# EAGLE design mcat-4cu-v2 (EAGLE 6.5.0)

## Sheet 1 of 4
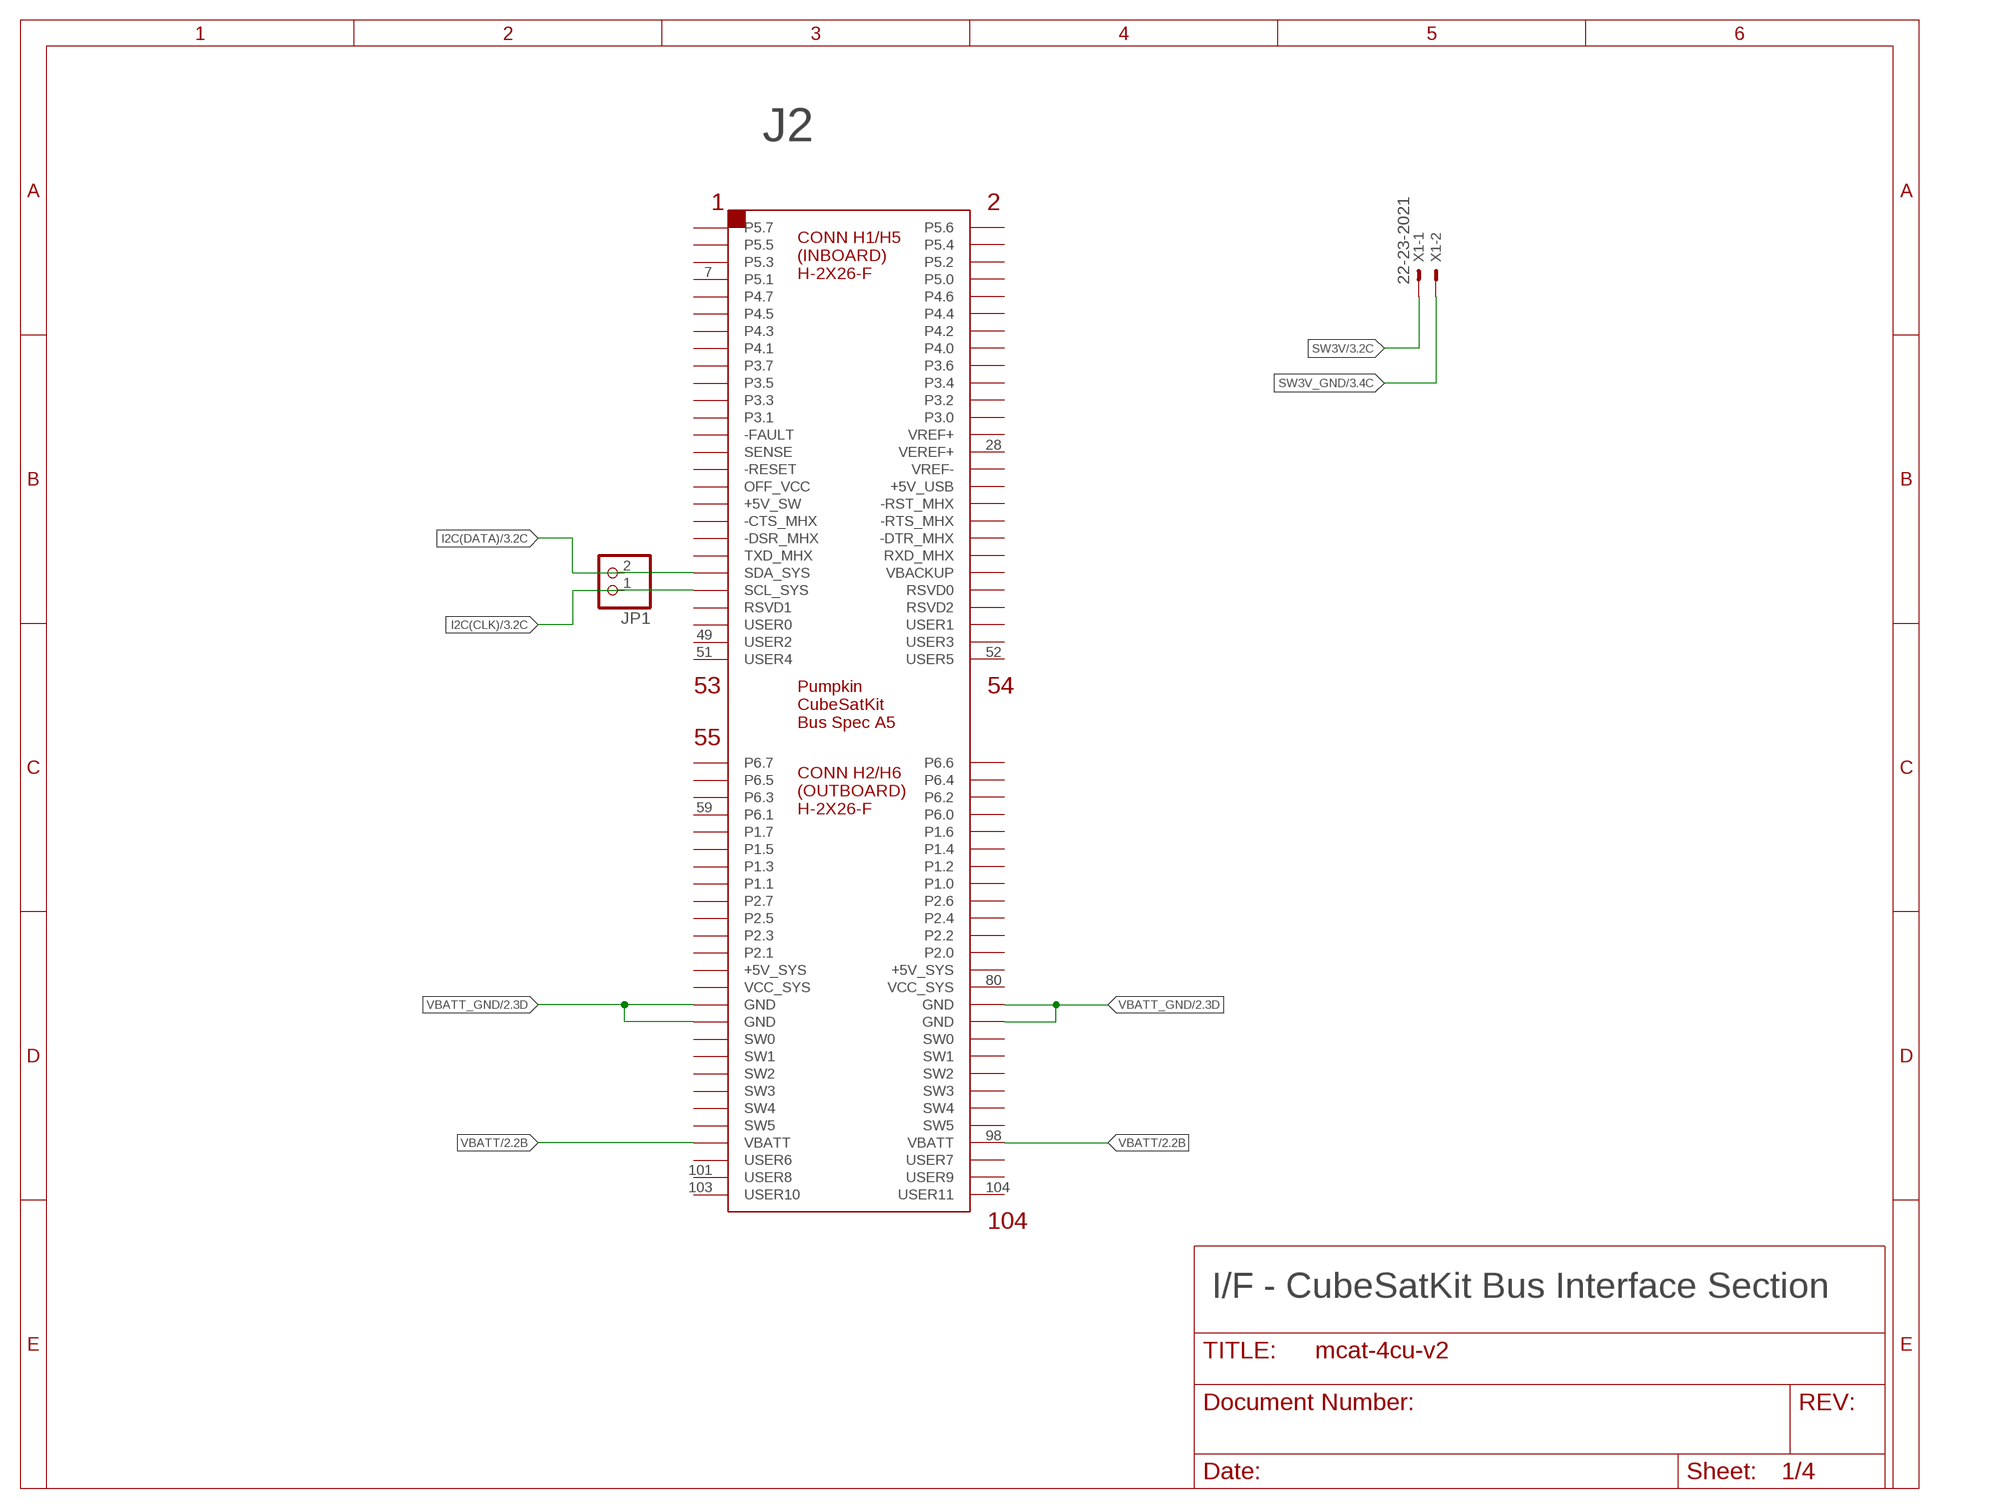
[diagram p0: schematic, sheet 1]

### Parts
J2  CSK-BUS-CONN2X2X26  [CSK-BUS-PKG]
JP1  PINHD-1X2  [1X02]
X1  22-23-2021  [22-23-2021]

### Nets
I2C(CLK): J2.43(SCL_SYS) JP1.1 ; also sheet 3
I2C(DATA): J2.41(SDA_SYS) JP1.2 ; also sheet 3
N$6: J2.82(GND) J2.84(GND)
SW3V: X1.1 ; also sheet 3
SW3V_GND: X1.2 ; also sheet 3
VBATT: J2.97(VBATT) J2.98(VBATT) ; also sheet 2
VBATT_GND: J2.81(GND) J2.83(GND) ; also sheet 2
Unconnected: J2.1(P5.7) J2.2(P5.6) J2.3(P5.5) J2.4(P5.4) J2.5(P5.3) J2.6(P5.2) J2.7(P5.1) J2.8(P5.0) J2.9(P4.7) J2.10(P4.6) J2.11(P4.5) J2.12(P4.4) J2.13(P4.3) J2.14(P4.2) J2.15(P4.1) J2.16(P4.0) J2.17(P3.7) J2.18(P3.6) J2.19(P3.5) J2.20(P3.4) J2.21(P3.3) J2.22(P3.2) J2.23(P3.1) J2.24(P3.0) J2.25(-FAULT) J2.26(VREF+) J2.27(SENSE) J2.28(VEREF+) J2.29(-RESET) J2.30(VREF-) J2.31(OFF_VCC) J2.32(+5V_USB) J2.33(+5V_SW) J2.34(-RST_MHX) J2.35(-CTS_MHX) J2.36(-RTS_MHX) J2.37(-DSR_MHX) J2.38(-DTR_MHX) J2.39(TXD_MHX) J2.40(RXD_MHX) J2.42(VBACKUP) J2.44(RSVD0) J2.45(RSVD1) J2.46(RSVD2) J2.47(USER0) J2.48(USER1) J2.49(USER2) J2.50(USER3) J2.51(USER4) J2.52(USER5) J2.53(P6.7) J2.54(P6.6) J2.55(P6.5) J2.56(P6.4) J2.57(P6.3) J2.58(P6.2) J2.59(P6.1) J2.60(P6.0) J2.61(P1.7) J2.62(P1.6) J2.63(P1.5) J2.64(P1.4) J2.65(P1.3) J2.66(P1.2) J2.67(P1.1) J2.68(P1.0) J2.69(P2.7) J2.70(P2.6) J2.71(P2.5) J2.72(P2.4) J2.73(P2.3) J2.74(P2.2) J2.75(P2.1) J2.76(P2.0) J2.77(+5V_SYS) J2.78(+5V_SYS) J2.79(VCC_SYS) J2.80(VCC_SYS) J2.85(SW0) J2.86(SW0) J2.87(SW1) J2.88(SW1) J2.89(SW2) J2.90(SW2) J2.91(SW3) J2.92(SW3) J2.93(SW4) J2.94(SW4) J2.95(SW5) J2.96(SW5) J2.99(USER6) J2.100(USER7) J2.101(USER8) J2.102(USER9) J2.103(USER10) J2.104(USER11)

### Notes on the sheet
- I/F - CubeSatKit Bus Interface Section

## Sheet 2 of 4
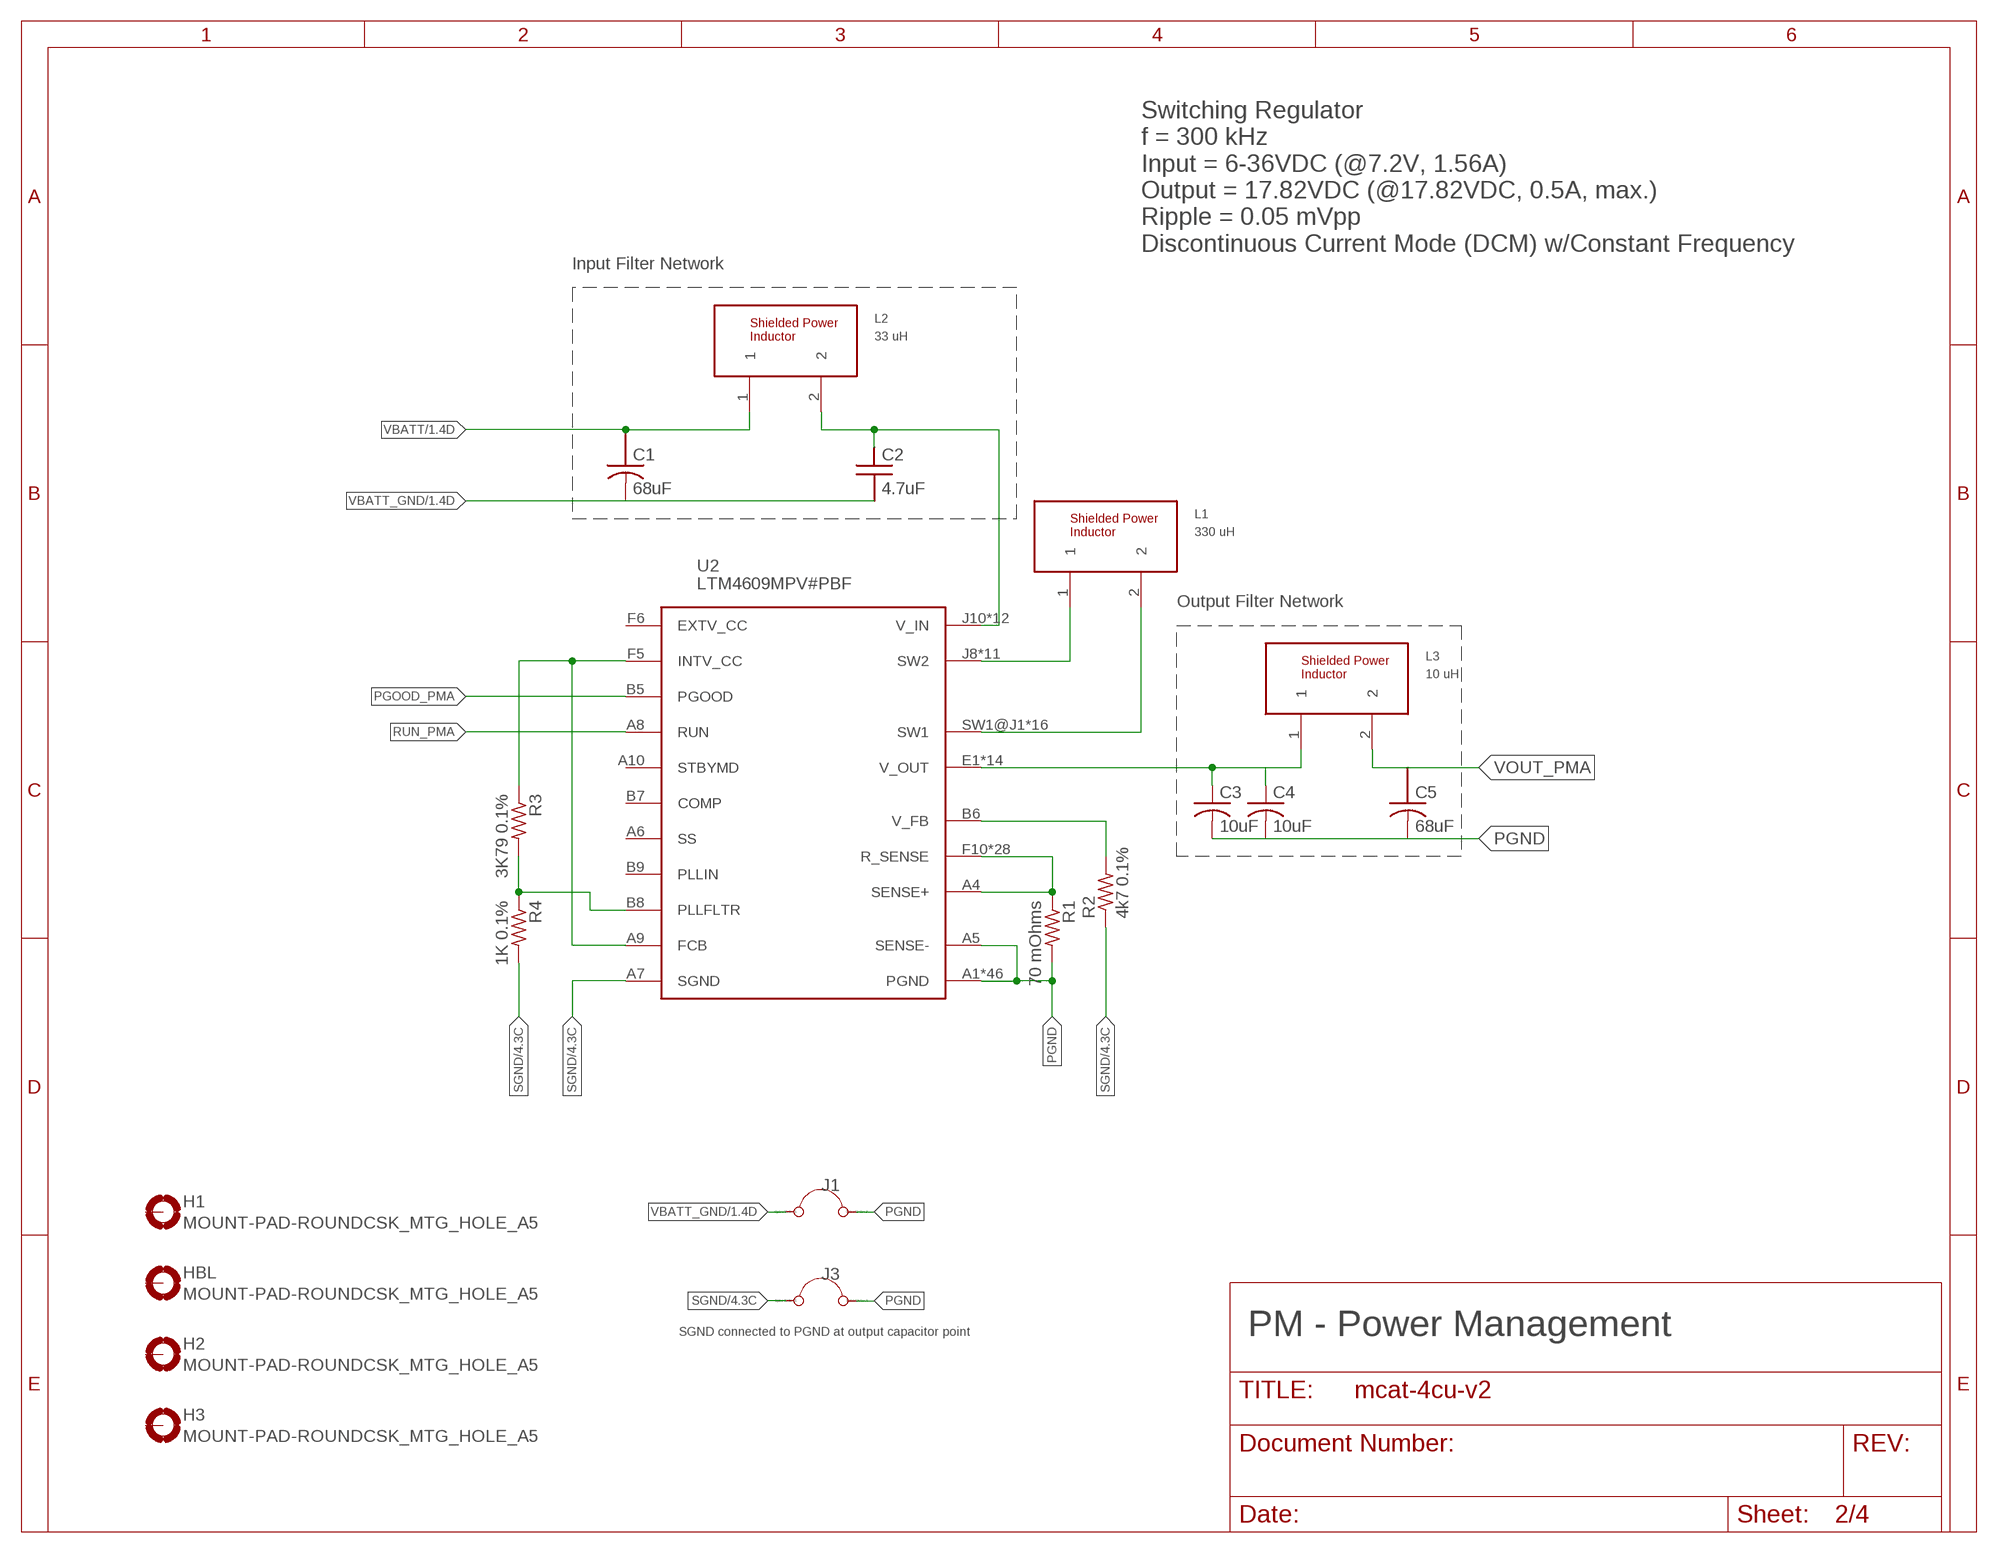
[diagram p1: schematic, sheet 2]

### Parts
C1  68uF  OSCON-50SVPF68M  [OS-CON-SVPF-F12]
C2  4.7uF  AVX-LD105C475KAB2A  [MLCC-X7R-1210]
C3  10uF  C-USC1210K  [C1210K]
C4  10uF  C-USC1210K  [C1210K]
C5  68uF  OSCON-50SVPF68M  [OS-CON-SVPF-F12]
H1  MOUNT-PAD-ROUNDCSK_MTG_HOLE_A5  [CSK_MOUNTING_HOLE]
H2  MOUNT-PAD-ROUNDCSK_MTG_HOLE_A5  [CSK_MOUNTING_HOLE]
H3  MOUNT-PAD-ROUNDCSK_MTG_HOLE_A5  [CSK_MOUNTING_HOLE]
HBL  MOUNT-PAD-ROUNDCSK_MTG_HOLE_A5  [CSK_MOUNTING_HOLE]
J1  JUMPER  [05]
J3  JUMPER  [05]
L1  330 uH  MSS1048-334KL_  [MSS1048]
L2  33 uH  MSS1038-333ML_  [MSS1048]
L3  10 uH  ELL-5PS100M  [SERIES-POWER-INDUCTORS]
R1  70 mOhms  R-US_R1206  [R1206]
R2  4k7 0.1%  R-US_R0603  [R0603]
R3  3K79 0.1%  R-US_R0805  [R0805]
R4  1K 0.1%  R-US_R0805  [R0805]
U2  LTM4609MPV#PBF  LTM4609MPV#PBFROHS/HITEMP  [LGA-141-LTC-05-08-1840-B]

### Nets
INTVCC_OUT: R3.1 U2.A9(FCB) U2.F5(INTV_CC)
N$2: R1.1 U2.A4(SENSE+) U2.F10(R_SENSE) U2.F11(R_SENSE) U2.F12(R_SENSE) U2.G5(R_SENSE) U2.G6(R_SENSE) U2.G7(R_SENSE) U2.G8(R_SENSE) U2.G9(R_SENSE) U2.G10(R_SENSE) U2.G11(R_SENSE) U2.G12(R_SENSE) U2.H5(R_SENSE) U2.H6(R_SENSE) U2.H7(R_SENSE) U2.H8(R_SENSE) U2.H9(R_SENSE) U2.H10(R_SENSE) U2.H11(R_SENSE) U2.H12(R_SENSE) U2.J5(R_SENSE) U2.J6(R_SENSE) U2.J7(R_SENSE) U2.K5(R_SENSE) U2.K6(R_SENSE) U2.L5(R_SENSE) U2.L6(R_SENSE) U2.M5(R_SENSE) U2.M6(R_SENSE)
N$8: R2.2 U2.B6(V_FB)
PGND: C3.2 C4.2 C5.K1(K) J1.2(-) J3.2(-) R1.2 U2.A1(PGND) U2.A2(PGND) U2.A3(PGND) U2.A5(SENSE-) U2.A11(PGND) U2.A12(PGND) U2.B1(PGND) U2.B2(PGND) U2.B3(PGND) U2.B4(PGND) U2.B10(PGND) U2.B11(PGND) U2.B12(PGND) U2.C1(PGND) U2.C2(PGND) U2.C3(PGND) U2.C4(PGND) U2.C5(PGND) U2.C6(PGND) U2.C7(PGND) U2.C8(PGND) U2.C9(PGND) U2.C10(PGND) U2.C11(PGND) U2.C12(PGND) U2.D1(PGND) U2.D2(PGND) U2.D3(PGND) U2.D4(PGND) U2.D5(PGND) U2.D6(PGND) U2.D7(PGND) U2.D8(PGND) U2.D9(PGND) U2.D10(PGND) U2.D11(PGND) U2.D12(PGND) U2.E3(PGND) U2.E4(PGND) U2.E5(PGND) U2.E6(PGND) U2.E7(PGND) U2.E8(PGND) U2.E9(PGND) U2.E10(PGND) U2.E11(PGND) U2.E12(PGND)
PGOOD_PMA: U2.B5(PGOOD)
RUN_PMA: U2.A8(RUN)
SETFREQ: R3.2 R4.1 U2.B8(PLLFLTR)
SGND: J3.1(+) R2.1 R4.2 U2.A7(SGND) ; also sheet 4
SW1: L1.2 U2.SW1@J1(SW1) U2.SW1@J2(SW1) U2.SW1@J3(SW1) U2.SW1@J4(SW1) U2.SW1@K1(SW1) U2.SW1@K2(SW1) U2.SW1@K3(SW1) U2.SW1@K4(SW1) U2.SW1@L1(SW1) U2.SW1@L2(SW1) U2.SW1@L3(SW1) U2.SW1@L4(SW1) U2.SW1@M1(SW1) U2.SW1@M2(SW1) U2.SW1@M3(SW1) U2.SW1@M4(SW1)
SW2: L1.1 U2.J8(SW2) U2.J9(SW2) U2.K7(SW2) U2.K8(SW2) U2.K9(SW2) U2.L7(SW2) U2.L8(SW2) U2.L9(SW2) U2.M7(SW2) U2.M8(SW2) U2.M9(SW2)
VBATT: C1.A1(A) L2.1 ; also sheet 1
VBATT_GND: C1.K1(K) C2.2 J1.1(+) ; also sheet 1
VIN_PMA: C2.1 L2.2 U2.J10(V_IN) U2.J11(V_IN) U2.J12(V_IN) U2.K10(V_IN) U2.K11(V_IN) U2.K12(V_IN) U2.L10(V_IN) U2.L11(V_IN) U2.L12(V_IN) U2.M10(V_IN) U2.M11(V_IN) U2.M12(V_IN)
VOUT_PMA: C5.A1(A) L3.2
VOUTA: C3.1 C4.1 L3.1 U2.E1(V_OUT) U2.E2(V_OUT) U2.F1(V_OUT) U2.F2(V_OUT) U2.F3(V_OUT) U2.F4(V_OUT) U2.G1(V_OUT) U2.G2(V_OUT) U2.G3(V_OUT) U2.G4(V_OUT) U2.H2(V_OUT) U2.H3(V_OUT) U2.H4(V_OUT) U2.VOUT(V_OUT)
Unconnected: H1.P$1(MOUNT) H2.P$1(MOUNT) H3.P$1(MOUNT) HBL.P$1(MOUNT) U2.A6(SS) U2.A10(STBYMD) U2.B7(COMP) U2.B9(PLLIN) U2.F6(EXTV_CC)

### Notes on the sheet
- Switching Regulator
  f = 300 kHz
  Input = 6-36VDC (@7.2V, 1.56A)
  Output = 17.82VDC (@17.82VDC, 0.5A, max.)
  Ripple = 0.05 mVpp
  Discontinuous Current Mode (DCM) w/Constant Frequency
- Input Filter Network
- Output Filter Network
- SGND connected to PGND at output capacitor point | PM - Power Management

## Sheet 3 of 4
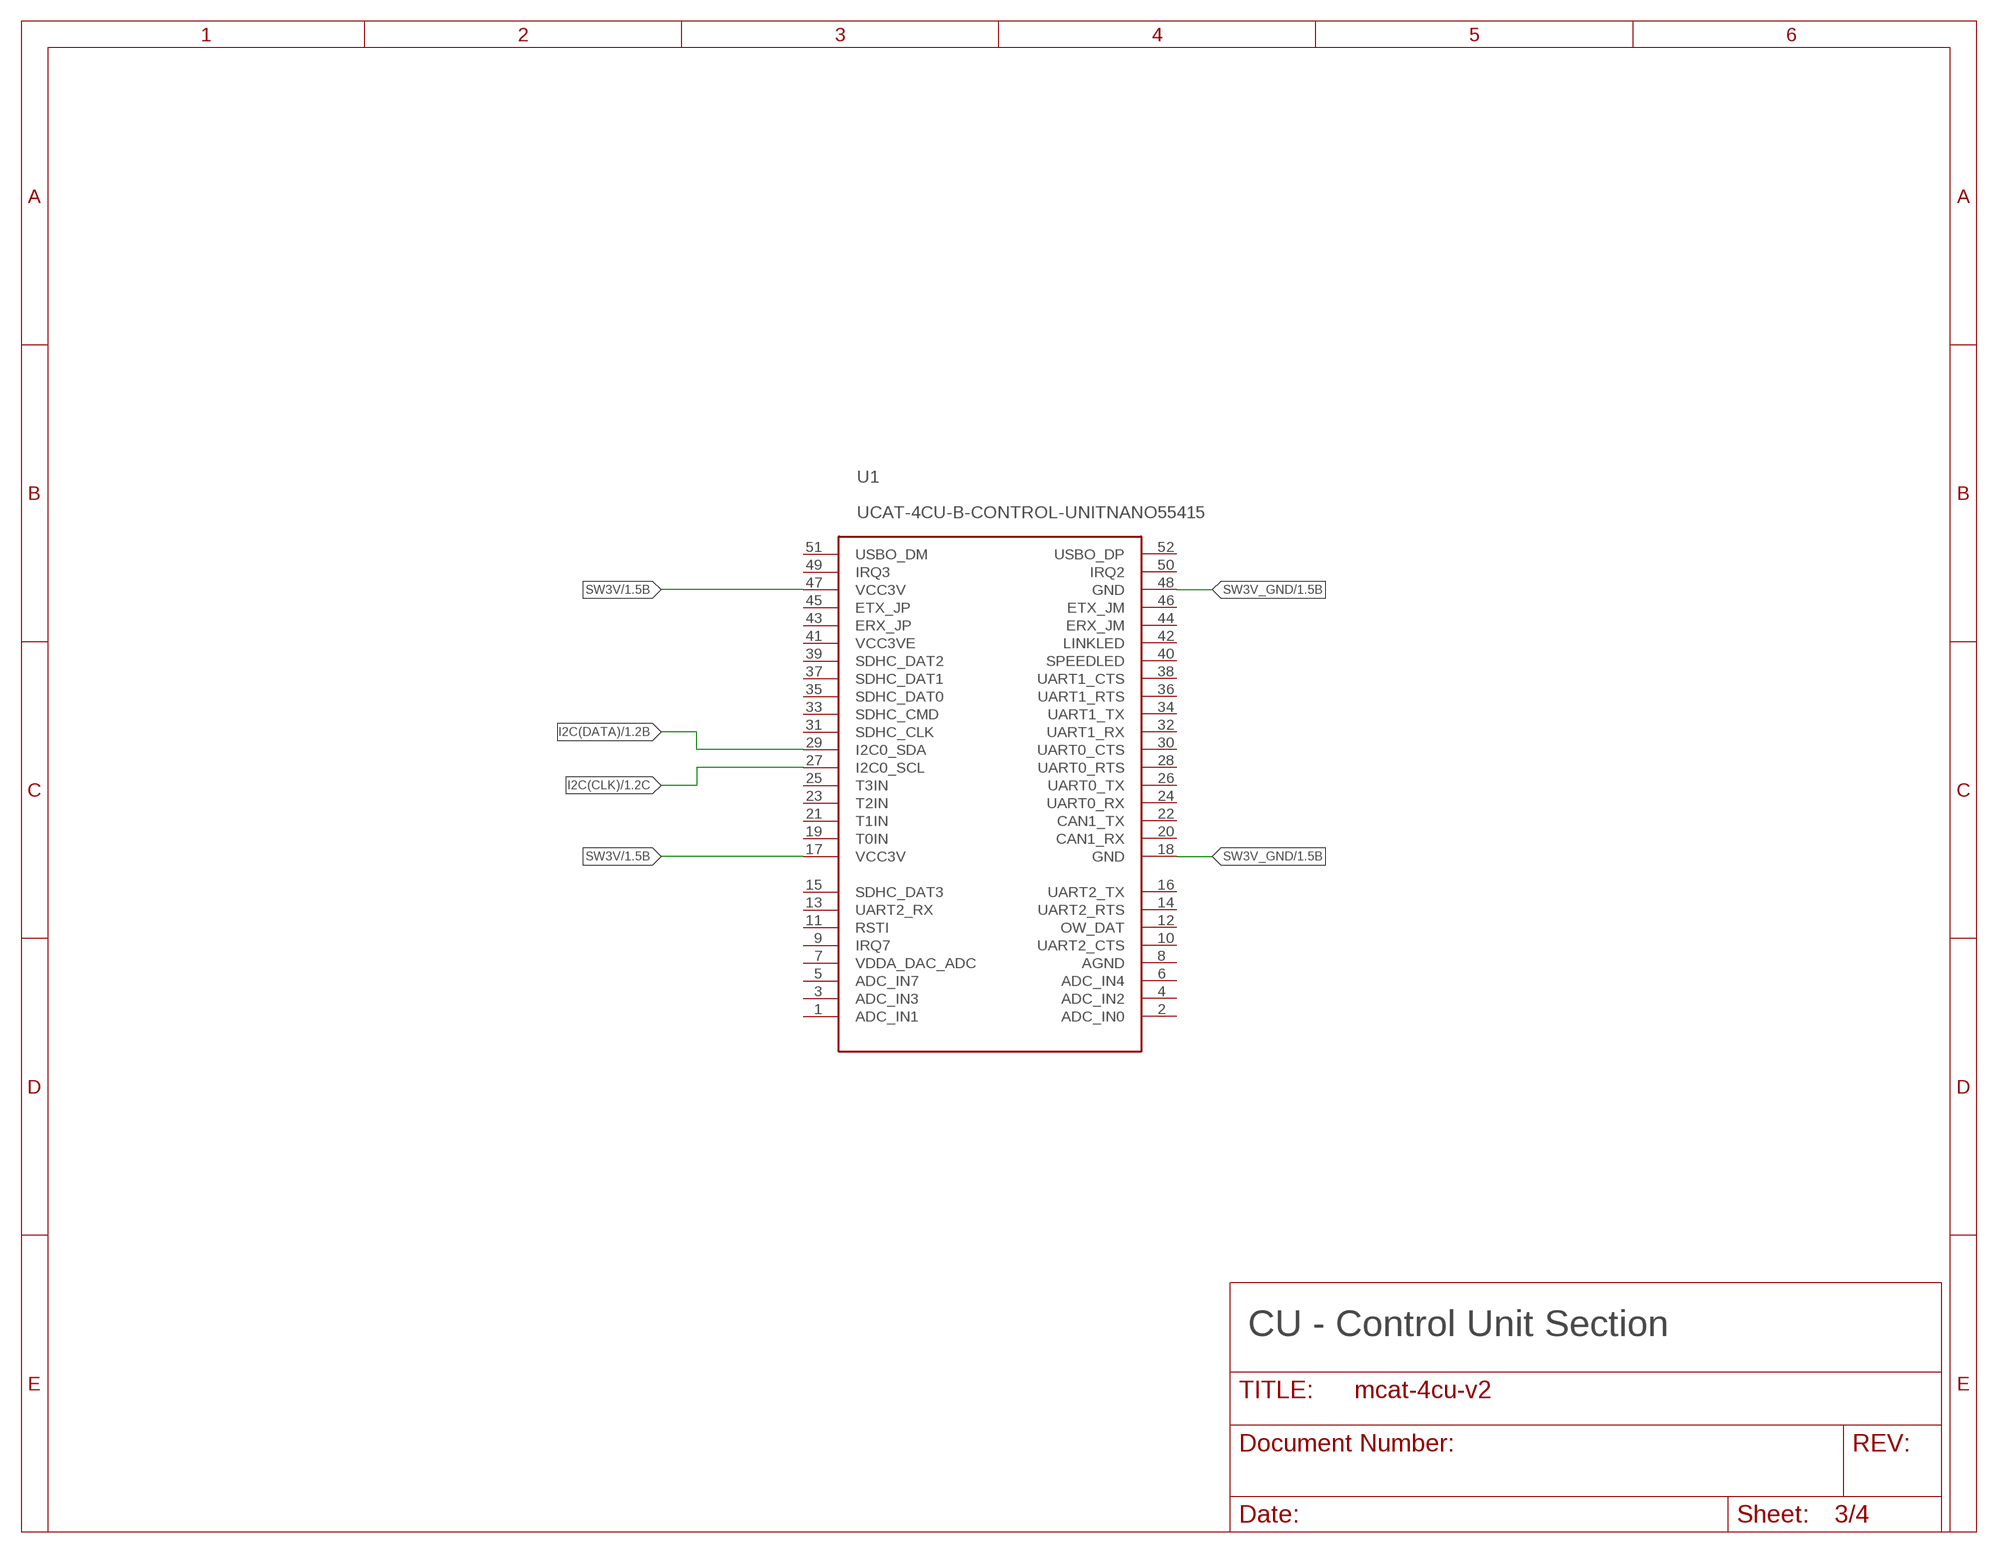
[diagram p2: schematic, sheet 3]

### Parts
U1  UCAT-4CU-B-CONTROL-UNITNANO55415  [MOLEX-MINI-PCI-EXPRESS-8MM-52CKT]

### Nets
I2C(CLK): U1.27(I2C0_SCL) ; also sheet 1
I2C(DATA): U1.29(I2C0_SDA) ; also sheet 1
N$3: U1.18(GND)
SW3V: U1.17(VCC3V) U1.47(VCC3V) ; also sheet 1
SW3V_GND: U1.48(GND) ; also sheet 1
Unconnected: U1.1(ADC_IN1) U1.2(ADC_IN0) U1.3(ADC_IN3) U1.4(ADC_IN2) U1.5(ADC_IN7) U1.6(ADC_IN4) U1.7(VDDA_DAC_ADC) U1.8(AGND) U1.9(IRQ7) U1.10(UART2_CTS) U1.11(RSTI) U1.12(OW_DAT) U1.13(UART2_RX) U1.14(UART2_RTS) U1.15(SDHC_DAT3) U1.16(UART2_TX) U1.19(T0IN) U1.20(CAN1_RX) U1.21(T1IN) U1.22(CAN1_TX) U1.23(T2IN) U1.24(UART0_RX) U1.25(T3IN) U1.26(UART0_TX) U1.28(UART0_RTS) U1.30(UART0_CTS) U1.31(SDHC_CLK) U1.32(UART1_RX) U1.33(SDHC_CMD) U1.34(UART1_TX) U1.35(SDHC_DAT0) U1.36(UART1_RTS) U1.37(SDHC_DAT1) U1.38(UART1_CTS) U1.39(SDHC_DAT2) U1.40(SPEEDLED) U1.41(VCC3VE) U1.42(LINKLED) U1.43(ERX_JP) U1.44(ERX_JM) U1.45(ETX_JP) U1.46(ETX_JM) U1.49(IRQ3) U1.50(IRQ2) U1.51(USBO_DM) U1.52(USBO_DP)

### Notes on the sheet
- CU - Control Unit Section

## Sheet 4 of 4
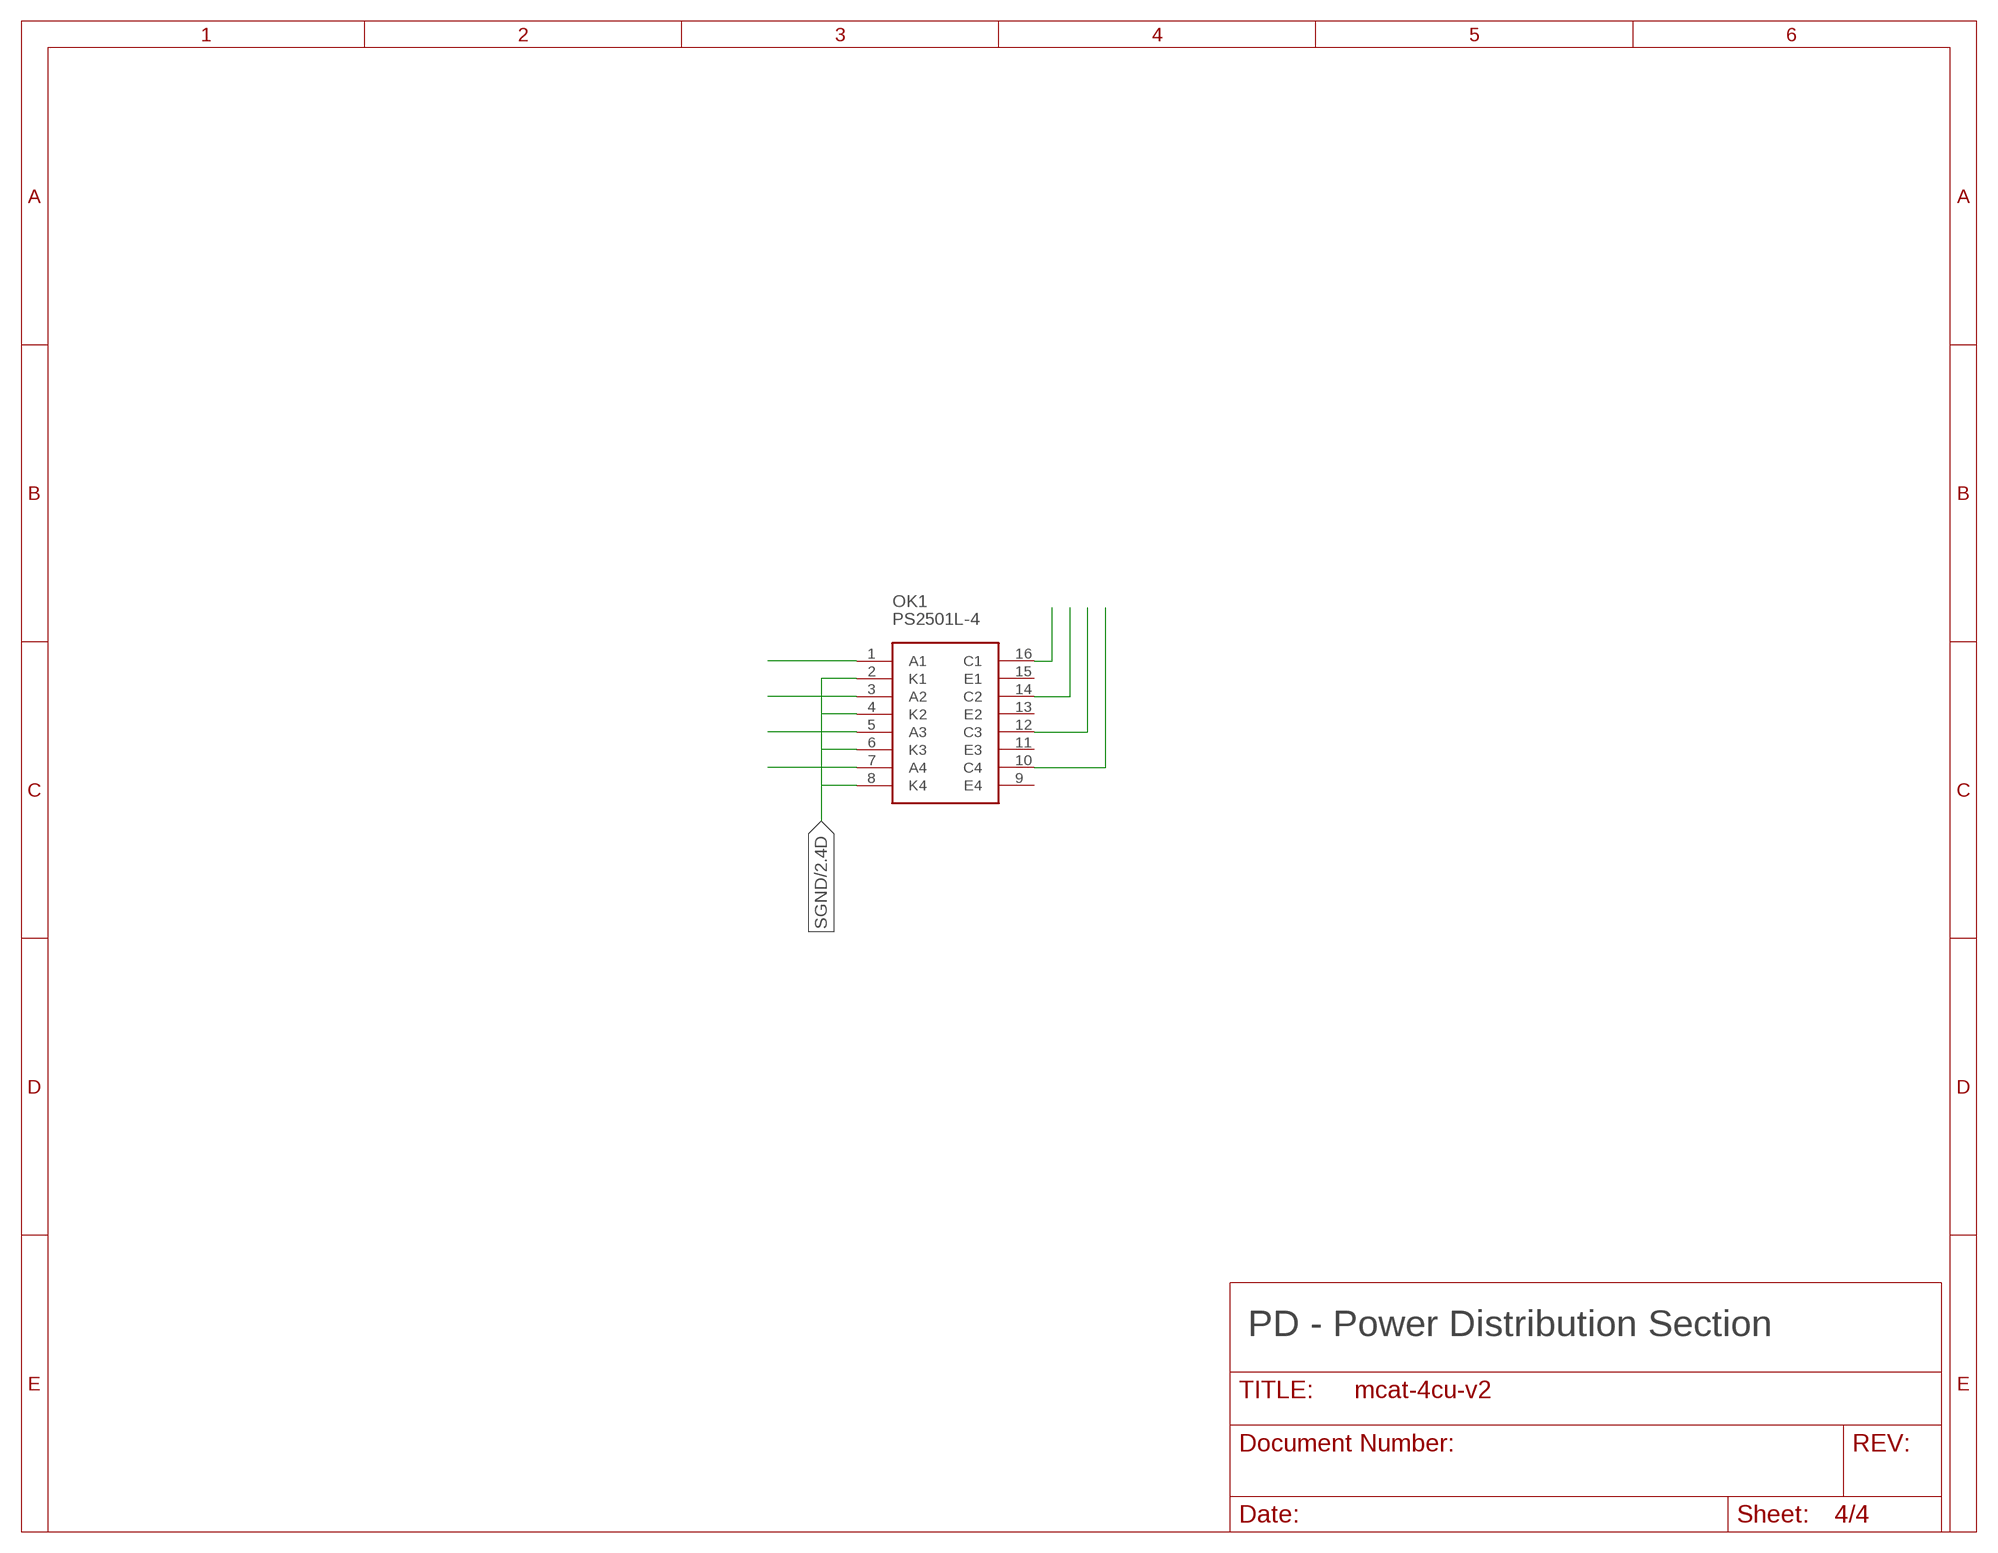
[diagram p3: schematic, sheet 4]

### Parts
OK1  PS2501L-4  [PS2501L-4]

### Nets
N$4: OK1.16(C1)
N$5: OK1.14(C2)
N$7: OK1.12(C3)
N$9: OK1.10(C4)
N$10: OK1.1(A1)
N$11: OK1.3(A2)
N$12: OK1.5(A3)
N$13: OK1.7(A4)
SGND: OK1.2(K1) OK1.4(K2) OK1.6(K3) OK1.8(K4) ; also sheet 2
Unconnected: OK1.9(E4) OK1.11(E3) OK1.13(E2) OK1.15(E1)

### Notes on the sheet
- PD - Power Distribution Section

## Library data of the parts
C1 C5 = gwu_mpnl_ucat_v8:OSCON-50SVPF
C2 = gwu_mpnl_ucat_v8:AVX-LD105C475KAB2A
C3 C4 = rcl:C-US: CAPACITOR, American symbol
H1-H3 HBL = mpnl_holes:MOUNT-PAD-ROUND: MOUNTING PAD, round
J1 J3 = Misc:JUMPER: A wire jumper. This component lets you give the same net two different names
J2 = gwu_mpnl_ucat_v8:CSK-BUS-CONN: Cubesat Kit Bus Connector 2 x Samtec ESQ-126-39-G-D Connectors 104 pins per Cubesat Kit Bus Spec A5
JP1 = pinhead:PINHD-1X2: PIN HEADER
L1 = gwu_mpnl_ucat_v8:MSS1048
L2 = gwu_mpnl_ucat_v8:MSS1038
L3 = gwu_mpnl_ucat_v8:ELL-5PS100M; MF: PANASONIC; MPN: ELL5PS100M; OC_FARNELL: 1717452
OK1 = gwu_mpnl_ucat_v8:PS2501L-4
R1 R2 = resistor:R-US_: RESISTOR, American symbol
R3 R4 = rcl:R-US_: RESISTOR, American symbol
U1 = gwu_mpnl_ucat_v8:UCAT-4CU-B-CONTROL-UNIT
U2 = gwu_mpnl_ucat_v8:LTM4609MPV#PBF: Per LTC Datasheet 4609fe LTM4609 (c) Samudra Haque, N3RDX, 2/23/2014
X1 = con-molex:22-23-2021: .100" (2.54mm) Center Header - 2 Pin; MF: MOLEX; MPN: 22-23-2021; OC_FARNELL: 1462926; OC_NEWARK: 25C3832

## Net classes
0 default: clearance 0.205 mm

## Board
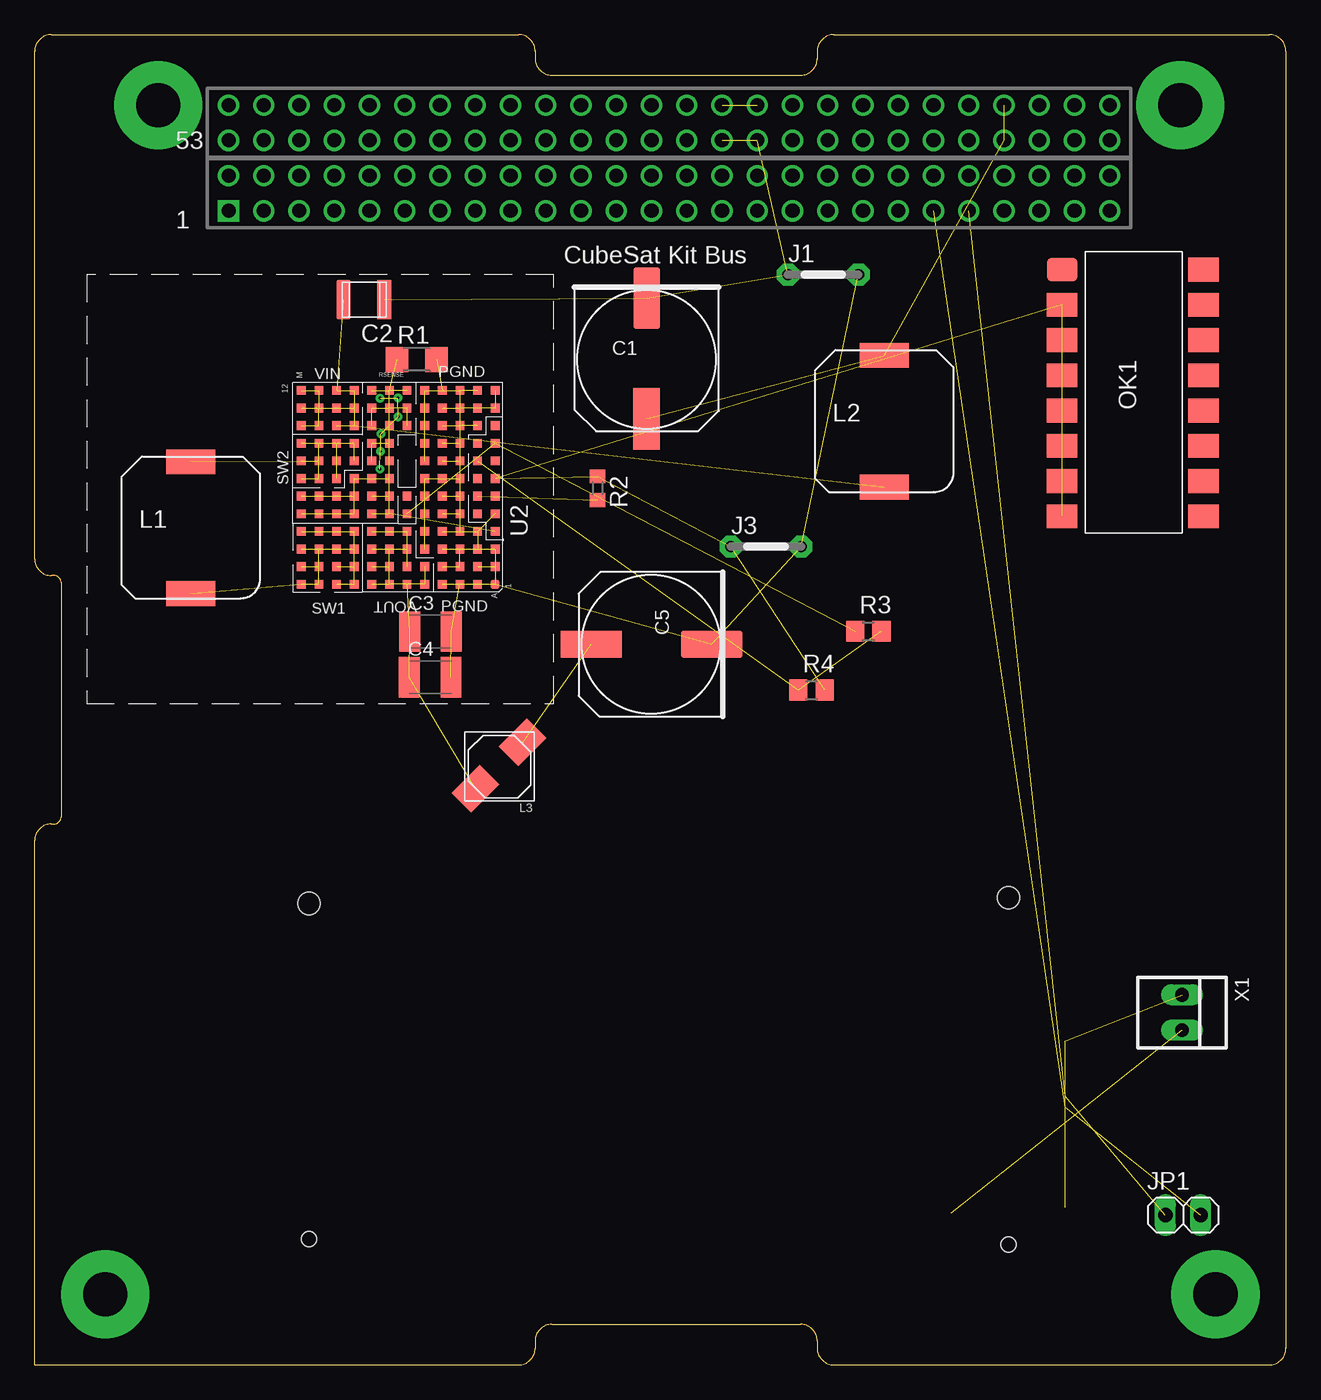
[diagram p4: board, top side]
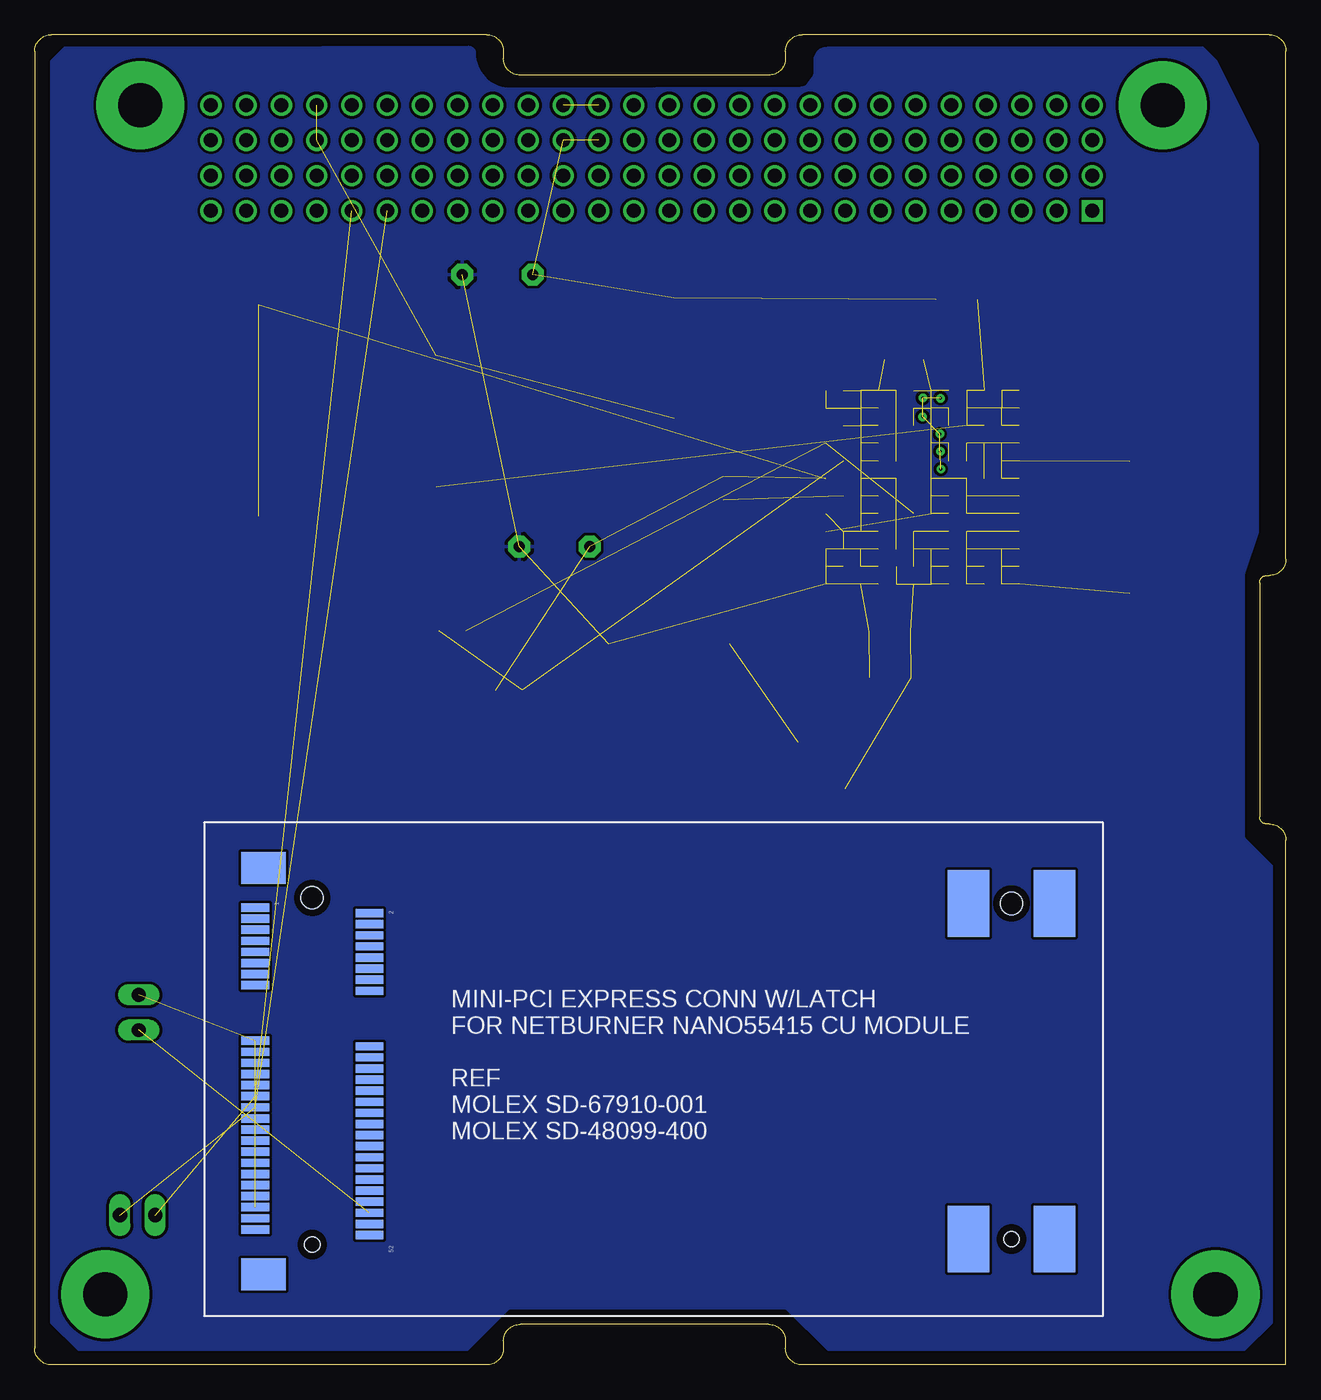
[diagram p5: board, bottom side, seen from below]

Size 90.17 x 95.89 mm. Coordinates in mm from the lower left corner, seen from the top.
Outline: 0,0 34.87,0 arc90 36.07,1.19 36.07,1.73 arc-90 37.26,2.92 55.19,2.92 arc-90 56.39,1.73 56.39,1.19 arc90 57.58,0 88.98,0 arc90 90.17,1.19 90.17,94.69 arc90 88.98,95.89 57.58,95.89 arc90 56.39,94.69 56.39,94.16 arc-90 55.19,92.96 37.26,92.96 arc-90 36.07,94.16 36.07,94.69 arc90 34.87,95.89 1.19,95.89 arc90 0,94.69 0,58.09 arc90 1.19,56.9 1.4,56.9 arc-90 1.91,56.39 1.91,39.5 arc-90 1.4,38.99 1.19,38.99 arc90 0,37.8 0,0
Copper layers [2:(1+(2*15)+16):15]: Top 0.0694mm / dielectric 8mil / Route2 0.0347mm / dielectric 3.5mil / Route15 0.0347mm / dielectric 8mil / Bottom 0.0694mm
Design rules "SSC-EAGLE-6Lyr_v1.0.0.3 *": minimum track width 6mil, minimum drill 8mil, track to track 6mil, track to pad 6mil, pad to pad 6mil, via to via 6mil, smd to smd 6mil, copper to edge 20mil, drill to drill 16mil, minimum pad ring 8mil, minimum via ring 8mil, stop-mask expansion 3mil, vias tented up to drill 0mil, thermal gap 10mil

### Footprints (pad centres in the part's own frame; a part is rotated, then mirrored left to right if it is on the bottom)
OS-CON-SVPF-F12 = smd 1.9 x 4.4: A1 0,-4.3; K1 0,4.4
MLCC-X7R-1210 = smd 1 x 2.8: 1 1.6,0.05; 2 -1.35,0.05
C1210K = smd 1.5 x 2.9: 1 -1.5,0; 2 1.5,0
CSK_MOUNTING_HOLE = drill 3.175 pad 6.35: P$1 0,0
05 = drill 0.813 pad 1.6 octagon: 1 -2.54,0; 2 2.54,0
CSK-BUS-PKG = drill 1.016 pad 1.524 square: 1 -29.21,-3.81 | drill 1.016 pad 1.524: 2 -29.21,-1.27; 3 -26.67,-3.81; 4 -26.67,-1.27; 5 -24.13,-3.81; 6 -24.13,-1.27; 7 -21.59,-3.81; 8 -21.59,-1.27; 9 -19.05,-3.81; 10 -19.05,-1.27; 11 -16.51,-3.81; 12 -16.51,-1.27; 13 -13.97,-3.81; 14 -13.97,-1.27; 15 -11.43,-3.81; 16 -11.43,-1.27; 17 -8.89,-3.81; 18 -8.89,-1.27; 19 -6.35,-3.81; 20 -6.35,-1.27; 21 -3.81,-3.81; 22 -3.81,-1.27; 23 -1.27,-3.81; 24 -1.27,-1.27; 25 1.27,-3.81; 26 1.27,-1.27; 27 3.81,-3.81; 28 3.81,-1.27; 29 6.35,-3.81; 30 6.35,-1.27; 31 8.89,-3.81; 32 8.89,-1.27; 33 11.43,-3.81; 34 11.43,-1.27; 35 13.97,-3.81; 36 13.97,-1.27; 37 16.51,-3.81; 38 16.51,-1.27; 39 19.05,-3.81; 40 19.05,-1.27; 41 21.59,-3.81; 42 21.59,-1.27; 43 24.13,-3.81; 44 24.13,-1.27; 45 26.67,-3.81; 46 26.67,-1.27; 47 29.21,-3.81; 48 29.21,-1.27; 49 31.75,-3.81; 50 31.75,-1.27; 51 34.29,-3.81; 52 34.29,-1.27; 53 -29.21,1.27; 54 -29.21,3.81; 55 -26.67,1.27; 56 -26.67,3.81; 57 -24.13,1.27; 58 -24.13,3.81; 59 -21.59,1.27; 60 -21.59,3.81; 61 -19.05,1.27; 62 -19.05,3.81; 63 -16.51,1.27; 64 -16.51,3.81; 65 -13.97,1.27; 66 -13.97,3.81; 67 -11.43,1.27; 68 -11.43,3.81; 69 -8.89,1.27; 70 -8.89,3.81; 71 -6.35,1.27; 72 -6.35,3.81; 73 -3.81,1.27; 74 -3.81,3.81; 75 -1.27,1.27; 76 -1.27,3.81; 77 1.27,1.27; 78 1.27,3.81; 79 3.81,1.27; 80 3.81,3.81; 81 6.35,1.27; 82 6.35,3.81; 83 8.89,1.27; 84 8.89,3.81; 85 11.43,1.27; 86 11.43,3.81; 87 13.97,1.27; 88 13.97,3.81; 89 16.51,1.27; 90 16.51,3.81; 91 19.05,1.27; 92 19.05,3.81; 93 21.59,1.27; 94 21.59,3.81; 95 24.13,1.27; 96 24.13,3.81; 97 26.67,1.27; 98 26.67,3.81; 99 29.21,1.27; 100 29.21,3.81; 101 31.75,1.27; 102 31.75,3.81; 103 34.29,1.27; 104 34.29,3.81
1X02 = drill 1.016 long: 1 -1.27,0; 2 1.27,0
MSS1048 = smd 3.56 x 1.78: 1 5,9.85; 2 5,0.35
SERIES-POWER-INDUCTORS = smd 2.85 x 2 rotated 45: 1 1.75,1.6; 2 -1.65,-1.75
PS2501L-4 = smd 2.2 x 1.7: 1 -1.6,19.03; 2 -1.6,16.49; 3 -1.6,13.95; 4 -1.6,11.41; 5 -1.6,8.87; 6 -1.6,6.33; 7 -1.6,3.79; 8 -1.6,1.25; 9 8.6,1.25; 10 8.6,3.79; 11 8.6,6.33; 12 8.6,8.87; 13 8.6,11.41; 14 8.6,13.95; 15 8.6,16.49; 16 8.6,19.03
R1206 = smd 1.6 x 1.803: 1 -1.422,0; 2 1.422,0
R0603 = smd 1 x 1.1: 1 -0.85,0; 2 0.85,0
R0805 = smd 1.3 x 1.5: 1 -0.95,0; 2 0.95,0
MOLEX-MINI-PCI-EXPRESS-8MM-52CKT = smd 0.6 x 2: 1 -11.65,-26.8; 2 -11.248,-18.576; 3 -10.85,-26.8; 4 -10.447,-18.576; 5 -10.05,-26.8; 6 -9.648,-18.576; 7 -9.25,-26.8; 8 -8.848,-18.576; 9 -8.45,-26.8; 10 -8.047,-18.576; 11 -7.65,-26.8; 12 -7.247,-18.576; 13 -6.85,-26.8; 14 -6.447,-18.576; 15 -6.05,-26.8; 16 -5.647,-18.576; 17 -2.05,-26.8; 18 -1.647,-18.576; 19 -1.25,-26.8; 20 -0.848,-18.576; 21 -0.45,-26.8; 22 -0.048,-18.576; 23 0.35,-26.8; 24 0.752,-18.576; 25 1.15,-26.8; 26 1.552,-18.576; 27 1.95,-26.8; 28 2.353,-18.576; 29 2.75,-26.8; 30 3.152,-18.576; 31 3.55,-26.8; 32 3.953,-18.576; 33 4.35,-26.8; 34 4.753,-18.576; 35 5.15,-26.8; 36 5.553,-18.576; 37 5.95,-26.8; 38 6.353,-18.576; 39 6.75,-26.8; 40 7.152,-18.576; 41 7.55,-26.8; 42 7.952,-18.576; 43 8.35,-26.8; 44 8.752,-18.576; 45 9.15,-26.8; 46 9.553,-18.576; 47 9.95,-26.8; 48 10.352,-18.576; 49 10.75,-26.8; 50 11.152,-18.576; 51 11.55,-26.8; 52 11.953,-18.576 | smd 2.3 x 3.2: P$1 -14.5,-26.2; P$2 14.8,-26.2 | smd 4.8 x 3: P$3 12.25,24.6; P$4 -11.95,24.6; P$5 -11.95,30.8; P$6 12.25,30.8 | hole 1.6: -12.35,-22.7; -11.95,27.7 | hole 1.1: 12.65,-22.7; 12.25,27.7
LGA-141-LTC-05-08-1840-B = smd 0.63 x 0.63: A1 -7.116,-10.192; A2 -5.846,-10.192; A3 -4.576,-10.192; A4 -3.306,-10.192; A5 -2.036,-10.192; A6 -0.766,-10.192; A7 0.504,-10.192; A8 1.774,-10.192; A9 3.044,-10.192; A10 4.314,-10.192; A11 5.584,-10.192; A12 6.854,-10.192; B1 -7.116,-8.922; B2 -5.846,-8.922; B3 -4.576,-8.922; B4 -3.306,-8.922; B5 -2.036,-8.922; B6 -0.766,-8.922; B7 0.504,-8.922; B8 1.774,-8.922; B9 3.044,-8.922; B10 4.314,-8.922; B11 5.584,-8.922; B12 6.854,-8.922; C1 -7.116,-7.652; C2 -5.846,-7.652; C3 -4.576,-7.652; C4 -3.306,-7.652; C5 -2.036,-7.652; C6 -0.766,-7.652; C7 0.504,-7.652; C8 1.774,-7.652; C9 3.044,-7.652; C10 4.314,-7.652; C11 5.584,-7.652; C12 6.854,-7.652; D1 -7.116,-6.382; D2 -5.846,-6.382; D3 -4.576,-6.382; D4 -3.306,-6.382; D5 -2.036,-6.382; D6 -0.766,-6.382; D7 0.504,-6.382; D8 1.774,-6.382; D9 3.044,-6.382; D10 4.314,-6.382; D11 5.584,-6.382; D12 6.854,-6.382; E1 -7.116,-5.112; E2 -5.846,-5.112; E3 -4.576,-5.112; E4 -3.306,-5.112; E5 -2.036,-5.112; E6 -0.766,-5.112; E7 0.504,-5.112; E8 1.774,-5.112; E9 3.044,-5.112; E10 4.314,-5.112; E11 5.584,-5.112; E12 6.854,-5.112; F1 -7.116,-3.842; F2 -5.846,-3.842; F3 -4.576,-3.842; F4 -3.306,-3.842; F5 -2.036,-3.842; F6 -0.766,-3.842; F10 4.314,-3.842; F11 5.584,-3.842; F12 6.854,-3.842; G1 -7.116,-2.572; G2 -5.846,-2.572; G3 -4.576,-2.572; G4 -3.306,-2.572; G5 -2.036,-2.572; G6 -0.766,-2.572; G7 0.504,-2.572; G8 1.774,-2.572; G9 3.044,-2.572; G10 4.314,-2.572; G11 5.584,-2.572; G12 6.854,-2.572; H2 -5.846,-1.302; H3 -4.576,-1.302; H4 -3.306,-1.302; H5 -2.036,-1.302; H6 -0.766,-1.302; H7 0.504,-1.302; H8 1.774,-1.302; H9 3.044,-1.302; H10 4.314,-1.302; H11 5.584,-1.302; H12 6.854,-1.302; J5 -2.036,-0.032; J6 -0.766,-0.032; J7 0.504,-0.032; J8 1.774,-0.032; J9 3.044,-0.032; J10 4.314,-0.032; J11 5.584,-0.032; J12 6.854,-0.032; K5 -2.036,1.238; K6 -0.766,1.238; K7 0.504,1.238; K8 1.774,1.238; K9 3.044,1.238; K10 4.314,1.238; K11 5.584,1.238; K12 6.854,1.238; L5 -2.036,2.508; L6 -0.766,2.508; L7 0.504,2.508; L8 1.774,2.508; L9 3.044,2.508; L10 4.314,2.508; L11 5.584,2.508; L12 6.854,2.508; M5 -2.036,3.778; M6 -0.766,3.778; M7 0.504,3.778; M8 1.774,3.778; M9 3.044,3.778; M10 4.314,3.778; M11 5.584,3.778; M12 6.854,3.778; SW1@J1 -7.116,-0.032; SW1@J2 -5.846,-0.032; SW1@J3 -4.576,-0.032; SW1@J4 -3.306,-0.032; SW1@K1 -7.116,1.238; SW1@K2 -5.846,1.238; SW1@K3 -4.576,1.238; SW1@K4 -3.306,1.238; SW1@L1 -7.116,2.508; SW1@L2 -5.846,2.508; SW1@L3 -4.576,2.508; SW1@L4 -3.306,2.508; SW1@M1 -7.116,3.778; SW1@M2 -5.846,3.778; SW1@M3 -4.576,3.778; SW1@M4 -3.306,3.778; VOUT -7.116,-1.302
22-23-2021 = drill 1 long: 1 -1.27,0; 2 1.27,0

### Placement (x,y rotation side)
C1  44.09,72.49 0 top
C2  23.85,76.83 180 top
C3  28.52,52.86 0 top
C4  28.5,49.56 0 top
C5  44.4,51.94 270 top
H1  8.89,90.81 0 top
H2  82.55,90.81 0 top
H3  85.09,5.08 0 top
HBL  5.08,5.08 0 top
J1  56.82,78.59 0 top
J2  43.18,87 0 top
J3  52.7,58.98 0 top
JP1  82.75,10.79 0 top
L1  6.25,55.25 0 top
L2  56.22,62.92 0 top
L3  33.5,43.13 180 top
OK1  75.64,59.92 0 top
R1  27.53,72.47 0 top
R2  40.56,63.2 270 top
R3  60.07,52.88 0 top
R4  55.98,48.64 0 top
U1  47.47,21.31 270 bottom
U2  22.99,63.38 90 top
X1  82.68,25.4 270 top

### Tracks (layer width: path | path; a pad name or v marks a point on that pad's centre or on a via)
I2C(CLK)  (2 unrouted)
I2C(DATA)  (2 unrouted)
INTVCC_OUT  (2 unrouted)
N$2  (29 unrouted)
N$6  (1 unrouted)
N$8  (1 unrouted)
PGND  (52 unrouted)
  pour Bottom (isolate 0.04): 3,57 3,38 1,36 1,3 3,1 33,1 36,4 56,4 59,1 87,1 89,3 89,94 88,95 80,95 58.93,95.07 arc90 58.42,94.56 arc-91 55.86,92.05 34.98,92.13 arc-54 34.41,92.42 34.14,92.81 arc-35 34,93.23 34,94.07 arc90 33.07,95 6,95 5,94 2,88 2,60
R_SENSE  (via drill 0.2)  (5 unrouted)
  Top 0.152: 24.93,67.09 v24.95,67.1 | 24.93,65.89 v24.91,65.85
  other vias: 24.87,64.57 24.89,69.68 26.19,68.35 26.17,69.7
SETFREQ  (2 unrouted)
SGND  (7 unrouted)
SW1  (16 unrouted)
SW2  (11 unrouted)
SW3V  (2 unrouted)
SW3V_GND  (1 unrouted)
VBATT  (3 unrouted)
VBATT_GND  (4 unrouted)
VIN_PMA  (13 unrouted)
VOUT_PMA  (1 unrouted)
VOUTA  (16 unrouted)